# Altium schematic sheet Sheet2.SchDoc
size A
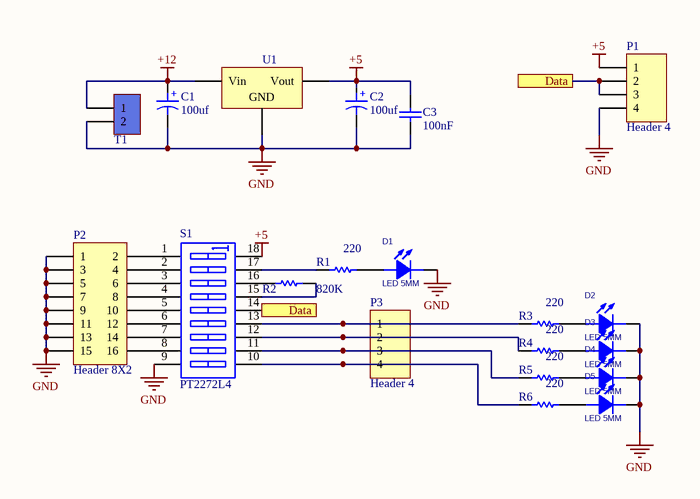
[diagram p0: Sheet2.SchDoc]

## Parts
C1  100uf  [Cap electrolitic radial 8x14-3.5]
C2  100uf  [Cap electrolitic radial 8x14-3.5]
C3  100nF  [Cap-100nF]
D1  LED 5MM  [LED5MM_BLUE]
D2  LED 5MM  [LED5MM_BLUE]
D3  LED 5MM  [LED5MM_BLUE]
D4  LED 5MM  [LED5MM_BLUE]
D5  LED 5MM  [LED5MM_BLUE]
P1  Header 4  [HDR1X4]
P2  Header 8X2  [HDR2X8]
P3  Header 4  [HDR1X4]
R1  220  [RES-(1/4)]
R2  820K  [RES-(1/4)]
R3  220  [RES-(1/4)]
R4  220  [RES-(1/4)]
R5  220  [RES-(1/4)]
R6  220  [RES-(1/4)]
S1  PT2272L4  [DIP-18]
T1  Terminal  [Terminal 1*2]  (value not drawn)
U1  L7805CV  [TO-220 AB]  (value not drawn)

## Ports
Data

## Nets
+5: C2.1 C3.2 P1.1 S1.18(B1) U1.3(Vout)
+12: C1.1 T1.1 U1.1(Vin)
GND: C1.2 C2.2 C3.1 D1.2(CATHODE) D2.2(CATHODE) D3.2(CATHODE) D4.2(CATHODE) D5.2(CATHODE) P1.4 P2.1 P2.3 P2.5 P2.7 P2.9 P2.11 P2.13 P2.15 S1.9(A9) T1.2 U1.2(GND)
Data: P1.2 P1.3 S1.14(B5) ; port Data
NetD1_1: D1.1(ANODE) R1.2
NetD2_1: D2.1(ANODE) R3.2
NetD3_1: D3.1(ANODE) R4.2
NetD4_1: D4.1(ANODE) R5.2
NetD5_1: D5.1(ANODE) R6.2
NetP2_2: P2.2 S1.1(A1)
NetP2_4: P2.4 S1.2(A2)
NetP2_6: P2.6 S1.3(A3)
NetP2_8: P2.8 S1.4(A4)
NetP2_10: P2.10 S1.5(A5)
NetP2_12: P2.12 S1.6(A6)
NetP2_14: P2.14 S1.7(A7)
NetP2_16: P2.16 S1.8(A8)
NetP3_1: P3.1 R3.1 S1.13(B6)
NetP3_2: P3.2 R4.1 S1.12(B7)
NetP3_3: P3.3 R5.1 S1.11(B8)
NetP3_4: P3.4 R6.1 S1.10(B9)
NetR1_1: R1.1 S1.17(B2)
NetR2_1: R2.1 S1.16(B3)
NetR2_2: R2.2 S1.15(B4)

## Notes on the sheet
- (in symbol Cap ELECTROLITIC TOTAL SIZE) +

## Library data of the parts
C1 C2 = Cap ELECTROLITIC TOTAL SIZE: Cap electrolitic radial; Designer: Abbas Basereh; VALUE: 1uF; Data: 16-12-2016; Part. No: *
C3 = CAP CERAMIC TOTAL SIZE: CAP Ceramic Total; Designer: Ali Hafizi
D1-D5 = LED 5MM: Light Emitting Diode; Designer: Abbas Basereh; Data: 16-12-2016; Link: *; Part.No: *
P1 P3 = Header 4: Header, 4-Pin; LatestRevisionDate: 17-Jul-2002; LatestRevisionNote: Re-released for DXP Platform.; Publisher: Altium Limited
P2 = Header 8X2: Header, 8-Pin, Dual row; LatestRevisionDate: 17-Jul-2002; LatestRevisionNote: Re-released for DXP Platform.; Publisher: Altium Limited
R1-R6 = RES DIP PACKAGE: TOTAL DIP RESISTOR PACK; Designer: Ali Hafizi
S1 = SW DIP-9: DIP Switch, 9 Position, SPST; Published: 24-Mar-1999; LatestRevisionDate: 17-Jul-2002; LatestRevisionNote: Re-released for DXP Platform.; PackageReference: DIP-18; Publisher: Altium Limited; Code_JEDEC: MO-036-AE
T1 = Terminal 1*2: Terminal 2 Pin 250VAC 16A; Designer: Seyed Mohsen Ghasemain; E-mail: picpars@gmail.com; ComponentLinkURL: www.picpars.com
U1 = L7805CV-Linear Voltage Regulator: Linear Voltage Regulator IC Positive FIXED Output 5V 1.5A TO-220AB; Manufacturer: STMicroelectronics; Designer: Abbas Basereh; Link: https://www.aliexpress.com/item/; Link: http://www.tme.eu/en/; Link: http://www.digikey.com/; Part. No: L7805CV